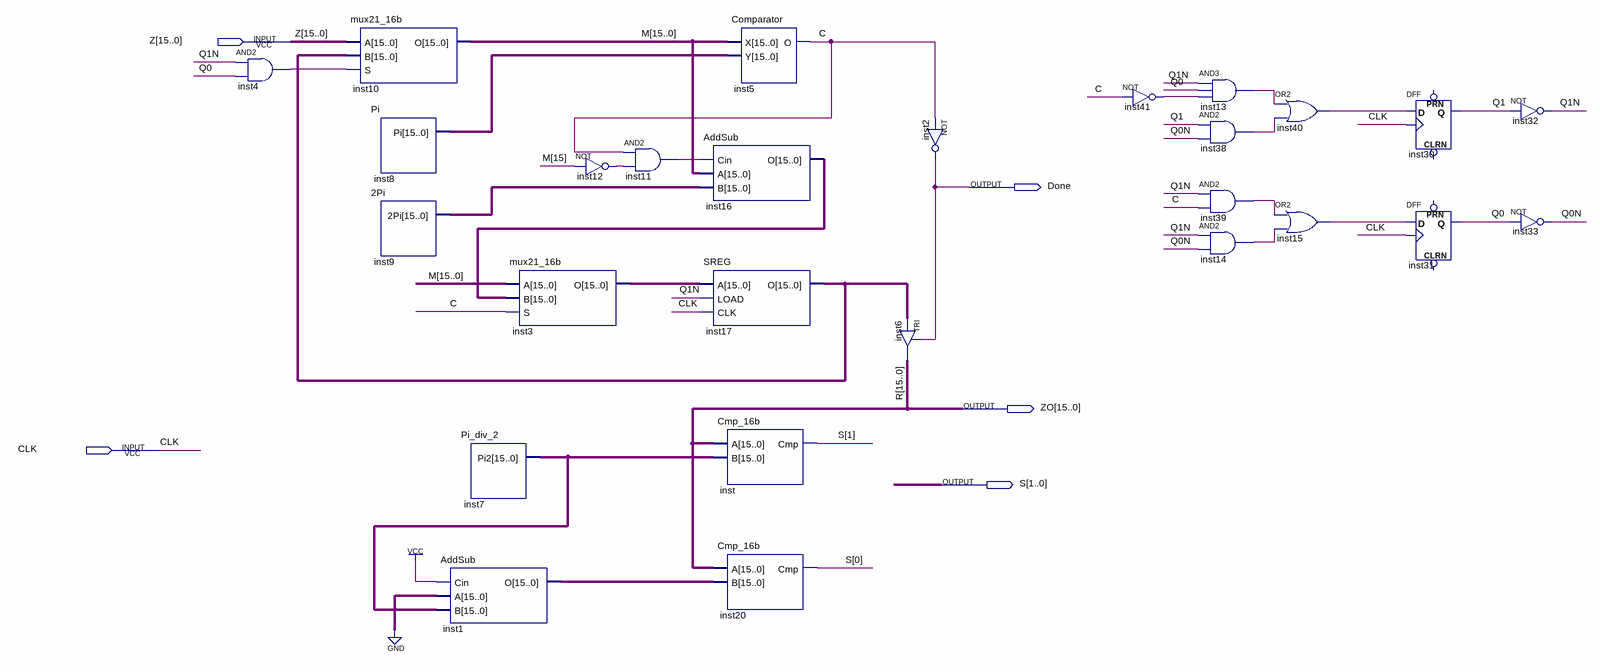
[diagram p0: schematic sheet]
// Quartus schematic AngleCalibration.bdf as structural Verilog: 27 symbols, 5 pins
module AngleCalibration (
  input  [15:0] Z,
  input  CLK,
  output Done,
  output [15:0] ZO,
  output [1:0] S
);

  wire C, inst4_out, inst11_out, inst12_out, inst13_out, inst14_out, inst15_out, inst38_out, inst39_out,
       inst40_out, inst41_out, Q0, Q0N, Q1, Q1N;
  wire [15:0] inst1_o, inst3_o, inst7_pi2, inst8_pi, inst9_2pi, inst16_o, inst17_o, M;

  and inst4 (inst4_out, Q1N, Q0);
  mux21_16b inst10 (.A(Z), .B(inst17_o), .S(inst4_out), .O(M));
  Pi inst8 (.Pi(inst8_pi));
  \2Pi  inst9 (.\2Pi (inst9_2pi));
  Pi_div_2 inst7 (.Pi2(inst7_pi2));
  AddSub inst1 (.Cin(1'b1), .A({16{1'b0}}), .B(inst7_pi2), .O(inst1_o));
  mux21_16b inst3 (.A(M), .B(inst16_o), .S(C), .O(inst3_o));
  not inst12 (inst12_out, M[15]);
  and inst11 (inst11_out, C, inst12_out);
  Comparator inst5 (.X(M), .Y(inst8_pi), .O(C));
  AddSub inst16 (.Cin(inst11_out), .A(M), .B(inst9_2pi), .O(inst16_o));
  SREG inst17 (.A(inst3_o), .LOAD(Q1N), .CLK(CLK), .O(inst17_o));
  Cmp_16b inst (.A(ZO), .B(inst7_pi2), .Cmp(S[1]));
  Cmp_16b inst20 (.A(ZO), .B(inst1_o), .Cmp(S[0]));
  TRI inst6[15:0] (.IN(inst17_o), .OE(Done), .OUT(ZO));
  not inst2 (Done, C);
  not inst41 (inst41_out, C);
  and inst13 (inst13_out, Q1N, Q0, inst41_out);
  and inst38 (inst38_out, Q1, Q0N);
  and inst39 (inst39_out, Q1N, C);
  and inst14 (inst14_out, Q1N, Q0N);
  or inst40 (inst40_out, inst13_out, inst38_out);
  or inst15 (inst15_out, inst39_out, inst14_out);
  DFF inst30 (.CLK(CLK), .D(inst40_out), .Q(Q1));  // open: CLRN, PRN
  DFF inst31 (.CLK(CLK), .D(inst15_out), .Q(Q0));  // open: CLRN, PRN
  not inst32 (Q1N, Q1);
  not inst33 (Q0N, Q0);

  // Other names for the same wires on the sheet: R[15:0] = ZO
endmodule
